# Altium project Control Board.PrjPcb
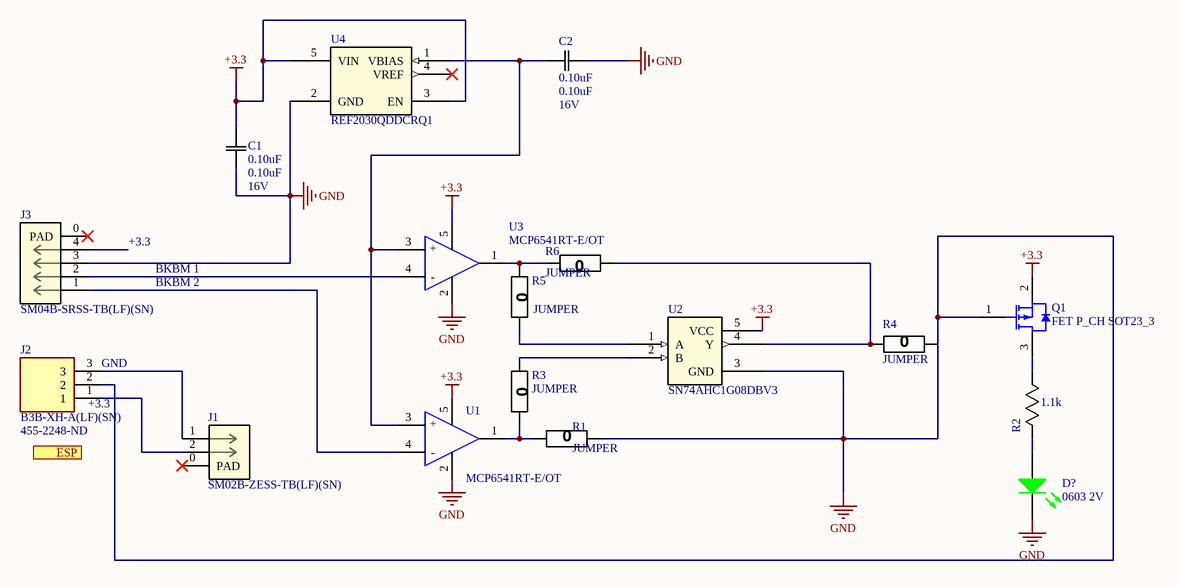
[diagram p0: Control Board.SchDoc]
1 sheet, 18 parts. Net scope: flat (ports and power ports of the same name join across sheets).
Board file: Control Board.PcbDoc

## Sheet Control Board.SchDoc
size A4; SheetNumber: 1; SheetTotal: 1; SPICEModelCacheOSASXLKA: <root> / <DocumentId>OSASXLKA</DocumentId> / </root>

### Parts
C1  0.10uF  Rating: 16V  [0603]
C2  0.10uF  Rating: 16V  [0603]
D1  0603 2V  [0603 - LED]
J1  SM02B-ZESS-TB(LF)(SN)  [CONN_SM02B-ZESS-TB_JST]
J2  B3B-XH-A(LF)(SN)  Supplier Part Number 1: 455-2248-ND  [JST_B3B-XH-A(LF)(SN)]
J3  SM04B-SRSS-TB(LF)(SN)  [CONN_SM04B_JST]
Q1  FET P_CH SOT23_3  [SOT-23 (3)]
Q2  MOSFET-P  [E3]
R1  JUMPER  [0603]
R2  1.1k  [0603]
R3  JUMPER  [0603]
R4  JUMPER  [0603]
R5  JUMPER  [0603]
R6  JUMPER  [0603]
U1  MCP6541RT-E/OT  [SOT-23-5_MC_MCH-L]
U2  SN74AHC1G08DBV3  [SOT-23-5_MC_MCH-L]
U3  MCP6541RT-E/OT  [SOT-23-5_MC_MCH-L]
U4  REF2030QDDCRQ1  [SOT-23-5_MC_MCH-L]

### Ports
ESP

### Nets
+3.3: C1.1(C1) Q1.2(SOURCE) U1.5(V+) U2.5(VCC) U3.5(V+) U4.3(EN) U4.5(VIN)
GND: C1.2(C2) C2.1(C1) D1.2(K) J2.2 J3.3 Q1.1(GATE) R1.2(R2) R4.2(R2) U1.2(V-) U2.3(GND) U3.2(V-) U4.2(GND)
NetC2_2: C2.2(C2) U1.3(IN+) U3.3(IN+) U4.1(VBIAS)
NetD1_1: D1.1(A) R2.2(R2)
NetJ1_1: J1.1 J2.3
NetJ1_2: J1.2 J2.1
NetJ3_1: J3.1 U1.4(IN-)
NetJ3_2: J3.2 U3.4(IN-)
NetQ1_3: Q1.3(DRAIN) R2.1(R1)
NetR1_1: R1.1(R1) R3.2(R2) U1.1(OUT)
NetR3_1: R3.1(R1) U2.2(B)
NetR4_1: R4.1(R1) R6.1(R1) U2.4(Y)
NetR5_1: R5.1(R1) R6.2(R2) U3.1(OUT)
NetR5_2: R5.2(R2) U2.1(A)

Not connected (* = marked no-connect by the designer): J1 0(PAD)*; J3 0(PAD)* 4; Q2 1(D) 2(G) 3(S); U4 4(VREF)*

### Notes on the sheet
- +3.3
- BKBM 1
- BKBM 2
- (near J2) GND
- (near J2) +3.3
- (in symbol COMPARATOR MCP6541RT-EOT) +; -

### Library data of the parts
C1 C2 = CAP 0.10uF 16V: CAP CER 0.10UF 16V X5R 0603; Tolerance: 10%; Package: 0603/0805; Temperature Coefficient: X5R; Operating Temperature: -55°C ~ 85°C; Value: 0.10uF; Part Number: CAP 0.10uF 16V
D1 = LED GREEN SMD 0603: LED Uni-Color Green 574nm 2-Pin Chip LED T/R; Manufacturer Part Number 1: LTST-C190KGKT; Current Rating: 20mA; Part Number: LED GREEN SMD 0603; Supplier 1: Digi-Key; Supplier Part Number 1: 160-1435-1-ND; Supplier URL 1: https://www.digikey.ca/en/products/detail/lite-on-inc/LTST-C190KGKT/386815?s=N4IgTCBcDaIIwDYAMBaOAWAzAVjSgcgCIgC6AvkA; Pin Count: 2; Voltage Rating - DC: 2V
J1 = CN HDR 2POS JST ZE: CONN HEADER SMD R/A 2POS 1.5MM; Mfr_Name: JST; Copyright: Copyright (C) 2023 Ultra Librarian. All rights reserved.; Manufacturer_Part_Number: SM02B-ZESS-TB; RefDes: RefDes; Type: DEV; Part Number: CN HDR 2POS JST ZE; Supplier 1: Digi-Key; Supplier Part Number 1: 455-2395-1-ND; Supplier URL 1: https://www.digikey.ca/en/products/detail/jst-sales-america-inc/SM02B-ZESS-TB-LF-SN/1887001; Pin Count: 2
J2 = CN HDR 3POS JST XH: Connector Header Through Hole 3 position 0.098 (2.50mm); MF: JST Sales; Check_prices: https://www.snapeda.com/parts/B3B-XH-A(LF)(SN)/JST%20Sales%20America%20Inc./view-part/231271/?ref=eda; Value: *; Package: None; Price: None; Availability: In Stock; MP: B3B-XH-A(LF)(SN); SnapEDA_Link: https://www.snapeda.com/parts/B3B-XH-A(LF)(SN)/JST%20Sales%20America%20Inc./view-part/231271/?ref=snap; Supplier 1: Digi-Key; Part Number: CN HDR 3POS JST XH; Manufacturer Part Number 1: B3B-XH-A(LF)(SN); Supplier URL 1: https://www.digikey.com/en/products/detail/jst-sales-america-inc/B3B-XH-A-LF-SN/1651046
J3 = CN HDR 4POS JST SH_SR: CONN HEADER SMD R/A 4POS 1MM; Mfr_Name: JST; Part Number: CN HDR 4POS JST SH_SR; Copyright: Copyright (C) 2023 Ultra Librarian. All rights reserved.; Manufacturer_Part_Number: SM04B-SRSS-TB(LF)(SN); Digi-Key_Part_Number_1: 455-1804-2-ND; Digi-Key_Part_Number_2: 455-1804-1-ND; Digi-Key_Part_Number_3: 455-1804-6-ND; RefDes: RefDes; Type: DEV; Supplier 1: Digi-Key; Supplier Part Number 1: 455-1804-1-ND; Supplier URL 1: https://www.digikey.ca/en/products/detail/jst-sales-america-inc/SM04B-SRSS-TB-LF-SN/926710; Pin Count: 4
Q1 = MOSFET P-CH CJ2305: P-Channel MOSFET General Purpose P-CH SOT23-3; Part Number: MOSFET P-CH CJ2305
Q2 = MOSFET-P: P-Channel MOSFET; Published: 8-Jun-2000; LatestRevisionDate: 17-Jul-2002; LatestRevisionNote: Re-released for DXP Platform.; PackageVersion: 1995/1996; PackageReference: E3; Publisher: Altium Limited; PackageDescription: TO, Flat Index; 3 In-Line, Axial Leads; Body Dia. 4.6mm; Lead Dia. 0.5 mm (max)
R1 R3-R6 = RES 0 JUMPER: RES SMD 0 OHM JUMPER GENERIC 0603; Manufacturer Part Number 1: RK73Z1JTTD; Value: 0; Tolerance: N/A; Package: 0805; Part Number: RES 0 JUMPER; Supplier 1: Digi-Key; Supplier Part Number 1: 2019-RK73Z1JTTDCT-ND; Supplier URL 1: https://www.digikey.ca/en/products/detail/koa-speer-electronics-inc/RK73Z1JTTD/9845478
R2 = RES 1.1k 1/8W: Default Resistor Symbol; Power (Watts): 0.125W; Tolerance: 5%; Package: 0805; Value: 1.1k; Part Number: RES 1.1k 1/8W
U1 U3 = COMPARATOR MCP6541RT-EOT: IC COMP 1.6V SNGL P-P SOT23-5; Part Number: COMPARATOR MCP6541RT-EOT; Manufacturer Part Number 1: MCP6541RT-E/OT; Supplier 1: Digi-Key; Supplier Part Number 1: MCP6541RT-E/OTCT-ND; Supplier URL 1: https://www.digikey.ca/en/products/detail/microchip-technology/MCP6541RT-E-OT/870211
U2 = SN74AHC1G08DBV3: IC GATE AND 1CH 2-INP SOT23-5; Mfr_Name: Texas Instruments; Copyright: Copyright (C) 2023 Ultra Librarian. All rights reserved.; Manufacturer_Part_Number: SN74AHC1G08DBV3; Digi-Key_Part_Number_1: 2156-SN74AHC1G08DBV3-ND; Digi-Key_Part_Number_2: 296-SN74AHC1G08DBV3CT-ND; Digi-Key_Part_Number_3: 296-SN74AHC1G08DBV3DKR-ND; Digi-Key_Part_Number_4: 296-SN74AHC1G08DBV3TR-ND; RefDes: RefDes; Type: DEV; Part Number: SN74AHC1G08DBV3; Manufacturer Part Number 1: SN74AHC1G08DBV3; Supplier 1: Digi-Key; Supplier Part Number 1: 296-SN74AHC1G08DBV3CT-ND; Supplier URL 1: https://www.digikey.ca/en/products/detail/texas-instruments/SN74AHC1G08DBV3/10434480
U4 = REF2030QDDCRQ1: Series Voltage Reference IC Fixed 1.5V, 3V V ±0.05% 20 mA SOT-23-THIN; Mfr_Name: Texas Instruments; Manufacturer_Part_Number: SN74AHC1G08DBV3; Copyright: Copyright (C) 2023 Ultra Librarian. All rights reserved.; Digi-Key_Part_Number_1: 2156-SN74AHC1G08DBV3-ND; Digi-Key_Part_Number_2: 296-SN74AHC1G08DBV3CT-ND; Digi-Key_Part_Number_3: 296-SN74AHC1G08DBV3DKR-ND; Digi-Key_Part_Number_4: 296-SN74AHC1G08DBV3TR-ND; RefDes: RefDes; Type: DEV; Part Number: REF2030QDDCRQ1; Manufacturer Part Number 1: REF2030QDDCRQ1; Supplier 1: Digi-Key; Supplier Part Number 1: 296-REF2030QDDCRQ1CT-ND; Supplier URL 1: https://www.digikey.ca/en/products/detail/texas-instruments/REF2030QDDCRQ1/15926651?s=N4IgjCBcpg7LBOKoDGUBmBDANgZwKYA0IA9lANogCsVAHHSALrEAOALlCAMpsBOAlgDsA5iAC%2BxALQAmZCDSQ%2BAVyKkK1JmK1A